# Altium schematic sheet InterfConnection.SchDoc
size 420 x 297 mm; Address1: Address1; Address2: Address2; Address3: Address3; Address4: Address4; SheetNumber: 4; SheetTotal: 4; Scale: 1:1; DocumentType: Схема электрическая принципиальная
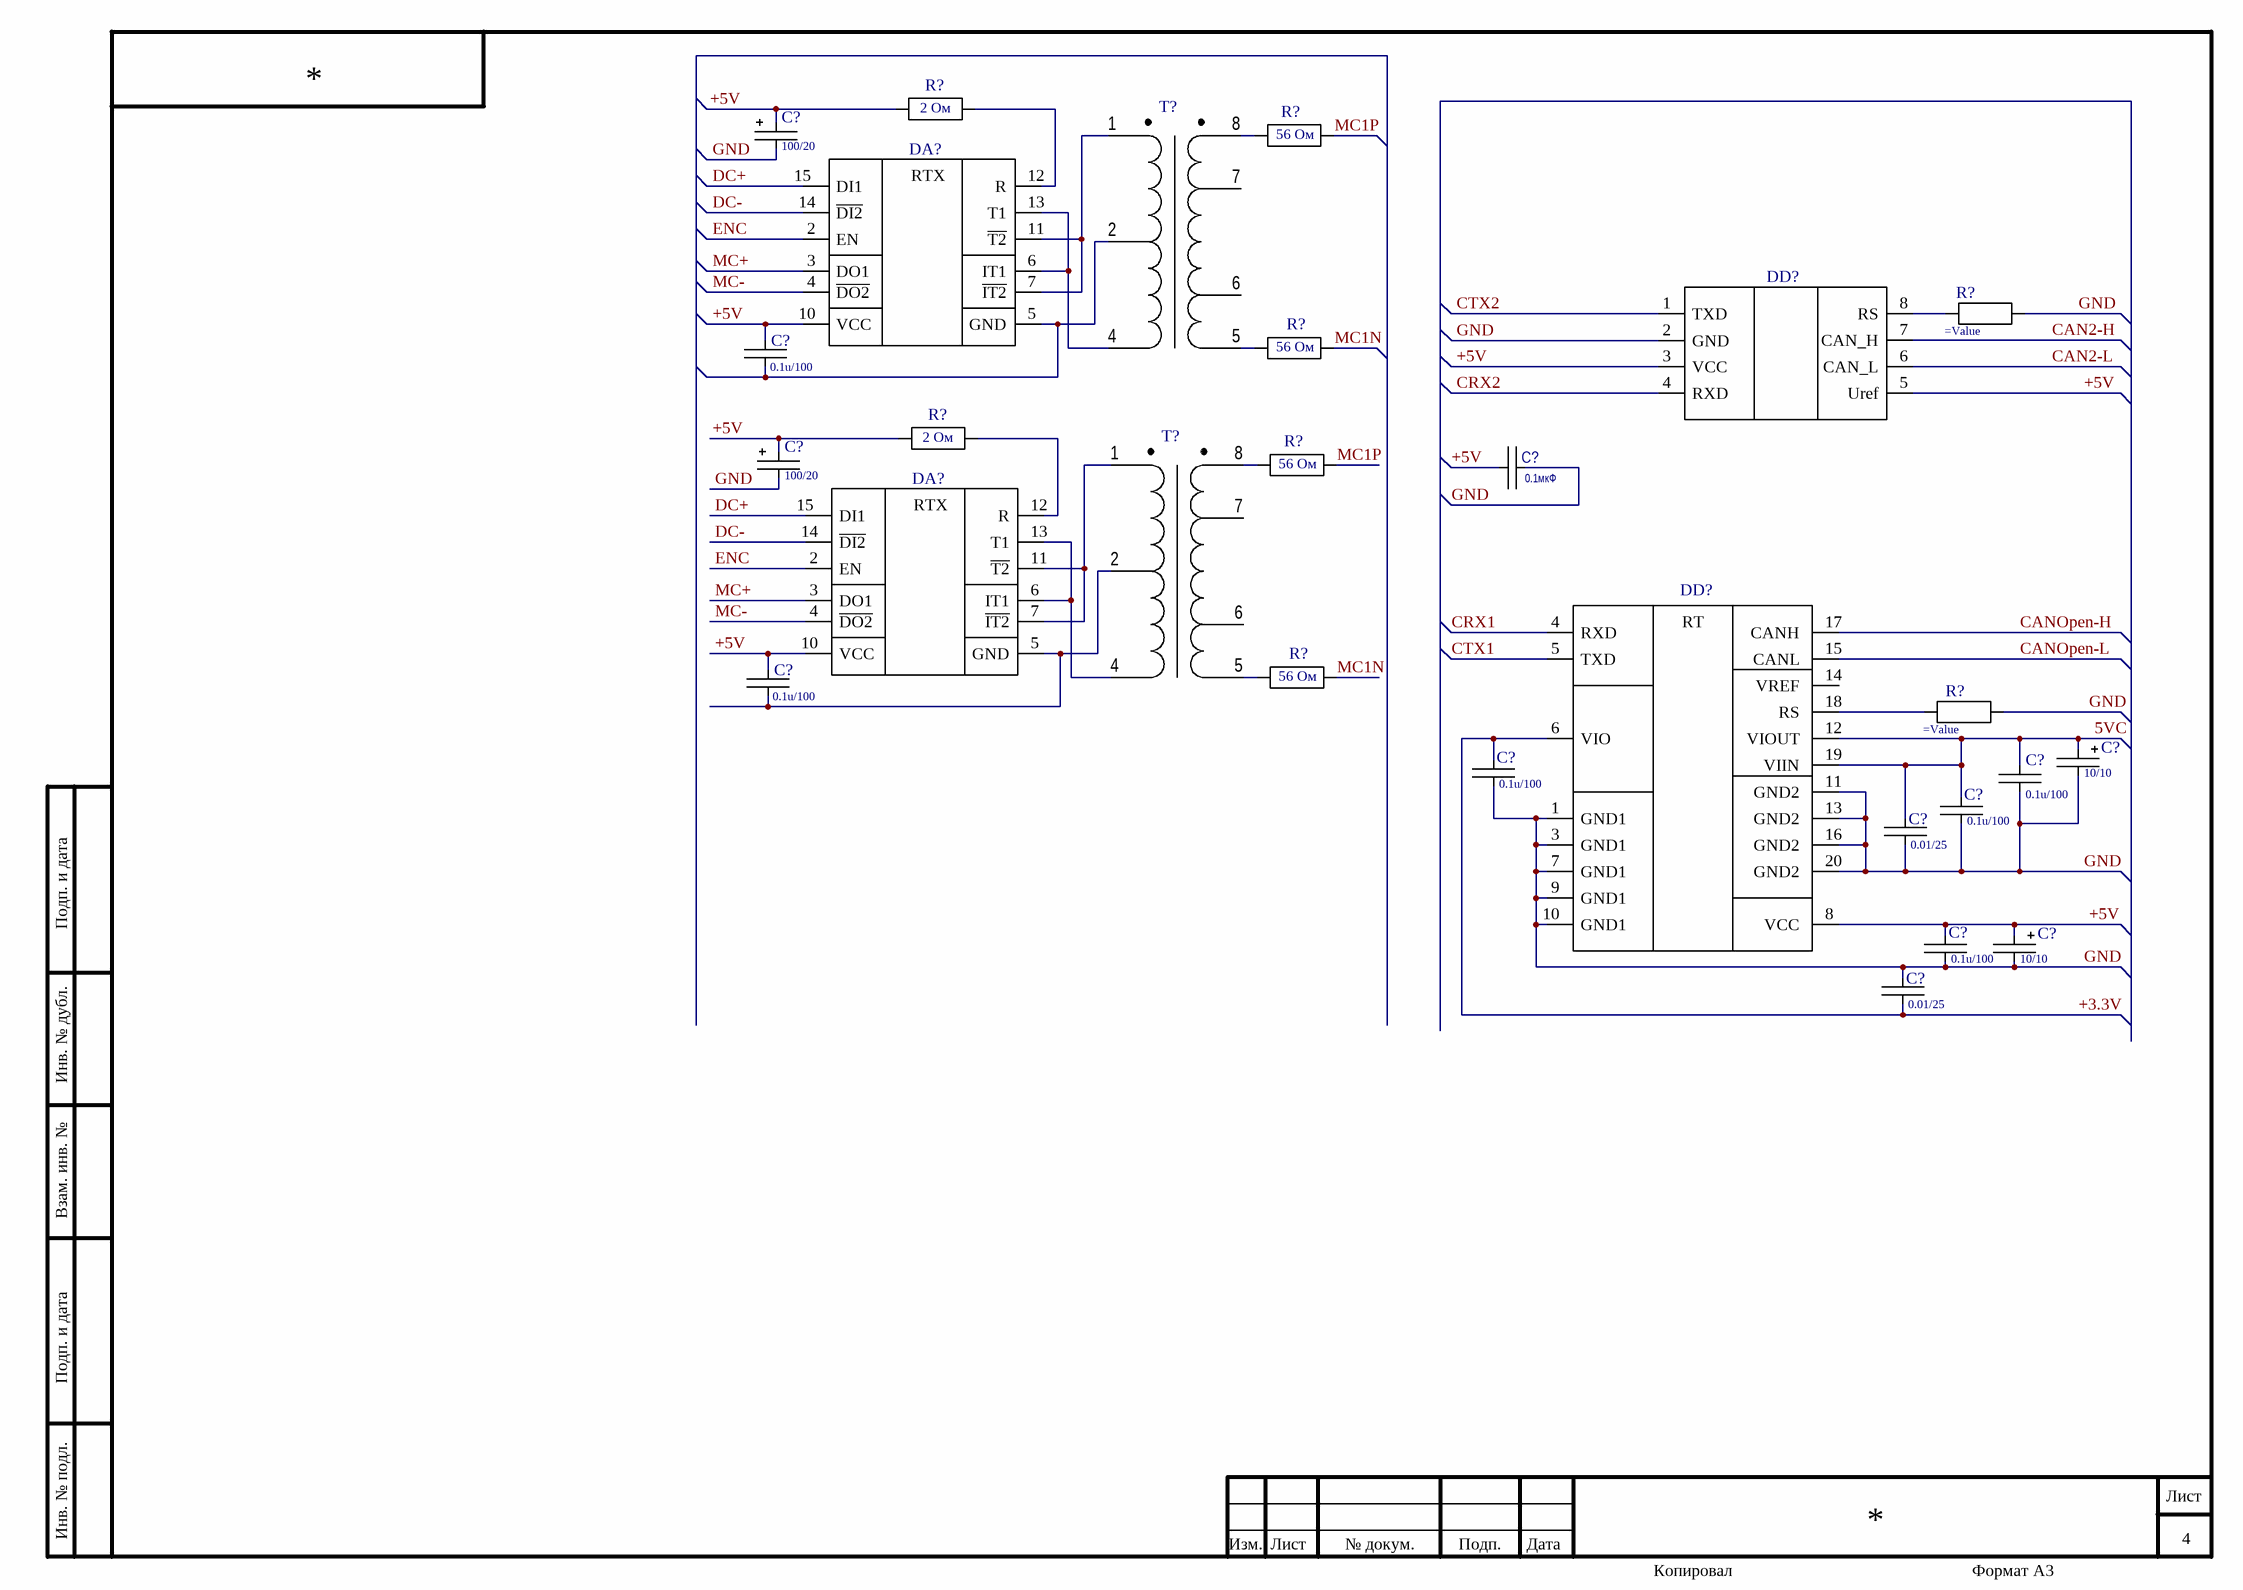
[diagram p0: InterfConnection.SchDoc]

## Parts
(Parts that share a designator on the sheet are numbered #1, #2 ... from top to bottom, then left to right.)
C?#1  100/20
C?#2  0.1u/100
C?#3  100/20
C?#4  0.1мкФ
C?#5  0.1u/100
C?#6  10/10
C?#7  0.1u/100
C?#8  0.1u/100
C?#9  0.1u/100
C?#10  0.01/25
C?#11  0.1u/100
C?#12  10/10
C?#13  0.01/25
DA?#1  5559ИН13У1  (value not drawn)
DA?#2  5559ИН13У1  (value not drawn)
DD?#1  ILA82C251D  (value not drawn)
DD?#2  ADM3053BRWZ-REEL7_1  (value not drawn)
R?#1  2 Ом
R?#2  56 Ом
R?#3  (no value)
R?#4  56 Ом
R?#5  2 Ом
R?#6  56 Ом
R?#7  56 Ом
R?#8  (no value)
Т?#1  (no value)
Т?#2  (no value)

## Nets
5VC: C?#6.1 C?#8.1 C?#9.1 C?#10.1 DD?#2.12(VIOUT) DD?#2.19(VIIN)
+3.3V: C?#7.1 C?#13.2 DD?#2.6(VIO)
+5V: C?#1.1 C?#2.1 C?#3.1 C?#4.1 C?#5.1 C?#11.1 C?#12.1 DA?#1.10(VCC) DA?#2.10(VCC) DD?#1.3(VCC) DD?#1.5(Uref) DD?#2.8(VCC) R?#1.1 R?#5.1
CAN2-H: DD?#1.7(CAN_H)
CAN2-L: DD?#1.6(CAN_L)
CANOpen-H: DD?#2.17(CANH)
CANOpen-L: DD?#2.15(CANL)
CRX1: DD?#2.4(RXD)
CRX2: DD?#1.4(RXD)
CTX1: DD?#2.5(TXD)
CTX2: DD?#1.1(TXD)
DC+: DA?#1.15(DI1) DA?#2.15(DI1)
DC-: DA?#1.14(~{DI2}) DA?#2.14(~{DI2})
ENC: DA?#1.2(EN) DA?#2.2(EN)
GND: C?#1.2 C?#3.2 C?#4.2 C?#6.2 C?#7.2 C?#8.2 C?#9.2 C?#10.2 C?#11.2 C?#12.2 C?#13.1 DD?#1.2(GND) DD?#2.1(GND1) DD?#2.3(GND1) DD?#2.7(GND1) DD?#2.9(GND1) DD?#2.10(GND1) DD?#2.11(GND2) DD?#2.13(GND2) DD?#2.16(GND2) DD?#2.20(GND2) R?#3.2 R?#8.2
MC1N: R?#4.2 R?#7.2
MC1P: R?#2.2 R?#6.2
MC+: DA?#1.3(DO1) DA?#2.3(DO1)
MC-: DA?#1.4(~{DO2}) DA?#2.4(~{DO2})
NetC?#2_2: C?#2.2 DA?#1.5(GND) Т?#1.2
NetC?#5_2: C?#5.2 DA?#2.5(GND) Т?#2.2
NetDA?#1_6: DA?#1.6(IT1) DA?#1.13(T1) Т?#1.4
NetDA?#1_7: DA?#1.7(~{IT2}) DA?#1.11(~{T2}) Т?#1.1
NetDA?#1_12: DA?#1.12(R) R?#1.2
NetDA?#2_6: DA?#2.6(IT1) DA?#2.13(T1) Т?#2.4
NetDA?#2_7: DA?#2.7(~{IT2}) DA?#2.11(~{T2}) Т?#2.1
NetDA?#2_12: DA?#2.12(R) R?#5.2
NetDD?#1_8: DD?#1.8(RS) R?#3.1
NetDD?#2_18: DD?#2.18(RS) R?#8.1
NetR?#2_1: R?#2.1 Т?#1.8
NetR?#4_1: R?#4.1 Т?#1.5
NetR?#6_1: R?#6.1 Т?#2.8
NetR?#7_1: R?#7.1 Т?#2.5

Not connected (* = marked no-connect by the designer): DD?#2 14(VREF_); Т?#1 6 7; Т?#2 6 7

## Notes on the sheet
- Подп. и дата
- Инв. № дубл.
- Взам. инв. №
- Инв. № подл.
- Изм.
- Лист
- № докум.
- Подп.
- Дата
- Копировал
- Формат А3
- (in symbol 5559ИН13У1) RTX
- (in symbol ADM3053BRWZ-REEL7_1) RT

## Library data of the parts
C?#1 C?#3 = К53-68E: Конденсатор полярный
C?#2 C?#4 C?#5 C?#10 C?#13 = К10-69: Керамический чип-конденсатор серии К10-79; PartNumber: К10-69в-*-* В- * ± *% *; TypePrefix: C; TU: АЖЯР.673511.002ТУ; TUHolder: ОАО НИИ "ГИРИКОНД"; Value: *; PackegeType: *
C?#6 C?#12 = К53-68B: Конденсатор / полярный
C?#7-C?#9 C?#11 = К10-69в-3225: Конденсатор неполярный
DA?#1 DA?#2 = 5559ИН13У1: МКИО приемопередатчик 5559ИН13Т
DD?#1 = ILA82C251D: CAN Приемопередатчик  ILA82C251D
DD?#2 = ADM3053BRWZ-REEL7_1: Микросборка CAN с гальванической развязкой
R?#1 R?#2 R?#4-R?#7 = Р1-12-0,5: Резистор постоянный
R?#3 R?#8 = Р1-12-0,125: Резистор постоянный
Т?#1 Т?#2 = ТИЛ6В: Трансформатор для ГОСТ Р 52070-2003